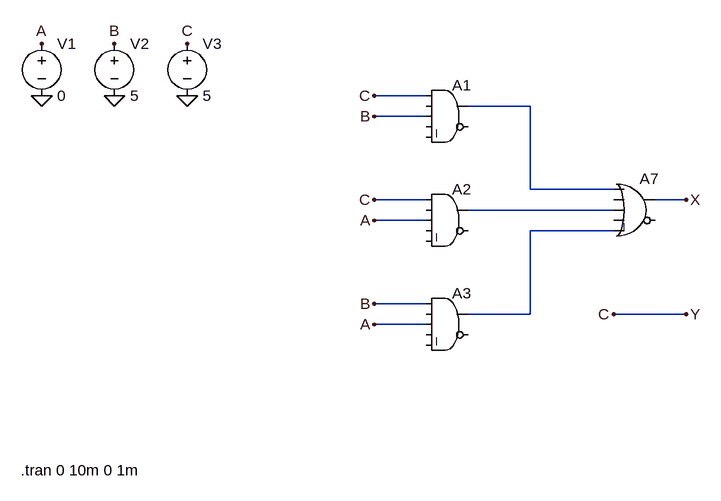
[diagram p0: schematic logik1.asc]
logik1.asc, the LTspice schematic file:
Version 4
SHEET 1 1152 720
WIRE 720 128 640 128
WIRE 880 144 784 144
WIRE 720 160 640 160
WIRE 880 272 880 144
WIRE 1008 272 880 272
WIRE 720 288 640 288
WIRE 1120 288 1072 288
WIRE 1008 304 784 304
WIRE 720 320 640 320
WIRE 1008 336 880 336
WIRE 720 448 640 448
WIRE 880 464 880 336
WIRE 880 464 784 464
WIRE 1120 464 1008 464
WIRE 720 480 640 480
FLAG 128 48 A
FLAG 240 48 B
FLAG 352 48 C
FLAG 1120 288 X
FLAG 640 320 A
FLAG 640 480 A
FLAG 640 448 B
FLAG 640 160 B
FLAG 640 288 C
FLAG 640 128 C
FLAG 128 128 0
FLAG 240 128 0
FLAG 352 128 0
FLAG 1120 464 Y
FLAG 1008 464 C
SYMBOL voltage 128 32 R0
WINDOW 123 0 0 Left 0
WINDOW 39 0 0 Left 0
SYMATTR InstName V1
SYMATTR Value 0
SYMBOL voltage 240 32 R0
WINDOW 123 0 0 Left 0
WINDOW 39 0 0 Left 0
SYMATTR InstName V2
SYMATTR Value 5
SYMBOL voltage 352 32 R0
WINDOW 123 0 0 Left 0
WINDOW 39 0 0 Left 0
SYMATTR InstName V3
SYMATTR Value 5
SYMBOL Digital\\and 752 96 R0
SYMATTR InstName A1
SYMATTR SpiceLine Vhigh=5V
SYMBOL Digital\\and 752 256 R0
SYMATTR InstName A2
SYMATTR SpiceLine Vhigh=5V
SYMBOL Digital\\and 752 416 R0
SYMATTR InstName A3
SYMATTR SpiceLine Vhigh=5V
SYMBOL Digital\\or 1040 240 R0
SYMATTR InstName A7
SYMATTR SpiceLine Vhigh=5V
TEXT 96 704 Left 2 !.tran 0 10m 0 1m

The netlist it stands for:
* logik1.asc
V1 A 0 0
V2 B 0 5
V3 Y 0 5
A1 Y 0 B 0 0 0 N001 0 AND Vhigh=5V
A2 Y 0 A 0 0 0 N002 0 AND Vhigh=5V
A3 B 0 A 0 0 0 N003 0 AND Vhigh=5V
A7 N001 0 N002 0 N003 0 X 0 OR Vhigh=5V
.tran 0 10m 0 1m
.backanno
.end